# EAGLE design LED Panel v1 (EAGLE 5.03)
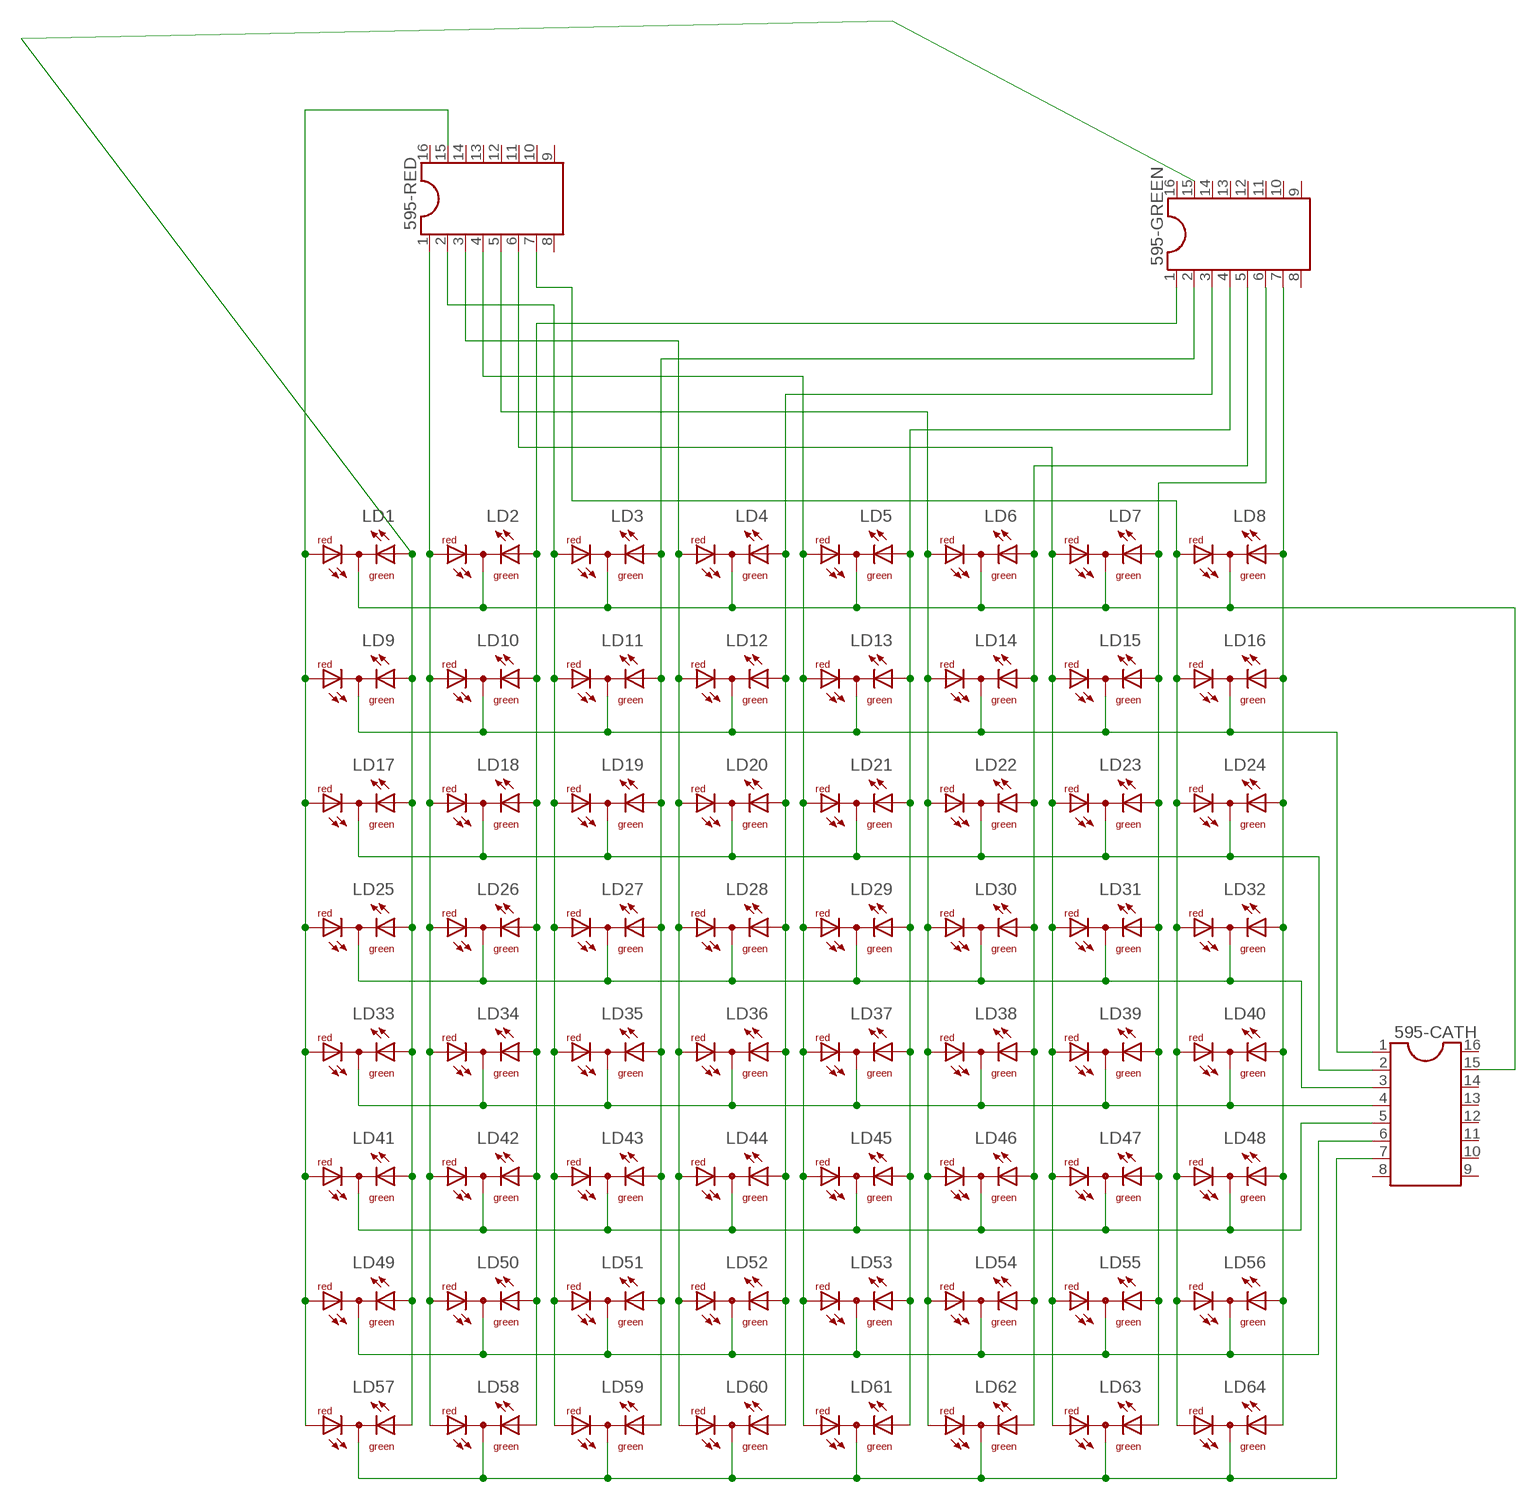
[diagram p0: schematic, sheet 1]

## Parts
595-CATH  DIL16  [DIL16]
595-GREEN  DIL16  [DIL16]
595-RED  DIL16  [DIL16]
LD1  DUOLED-RG-C  [DUOLED-C-5MM]
LD2  DUOLED-RG-C  [DUOLED-C-5MM]
LD3  DUOLED-RG-C  [DUOLED-C-5MM]
LD4  DUOLED-RG-C  [DUOLED-C-5MM]
LD5  DUOLED-RG-C  [DUOLED-C-5MM]
LD6  DUOLED-RG-C  [DUOLED-C-5MM]
LD7  DUOLED-RG-C  [DUOLED-C-5MM]
LD8  DUOLED-RG-C  [DUOLED-C-5MM]
LD9  DUOLED-RG-C  [DUOLED-C-5MM]
LD10  DUOLED-RG-C  [DUOLED-C-5MM]
LD11  DUOLED-RG-C  [DUOLED-C-5MM]
LD12  DUOLED-RG-C  [DUOLED-C-5MM]
LD13  DUOLED-RG-C  [DUOLED-C-5MM]
LD14  DUOLED-RG-C  [DUOLED-C-5MM]
LD15  DUOLED-RG-C  [DUOLED-C-5MM]
LD16  DUOLED-RG-C  [DUOLED-C-5MM]
LD17  DUOLED-RG-C  [DUOLED-C-5MM]
LD18  DUOLED-RG-C  [DUOLED-C-5MM]
LD19  DUOLED-RG-C  [DUOLED-C-5MM]
LD20  DUOLED-RG-C  [DUOLED-C-5MM]
LD21  DUOLED-RG-C  [DUOLED-C-5MM]
LD22  DUOLED-RG-C  [DUOLED-C-5MM]
LD23  DUOLED-RG-C  [DUOLED-C-5MM]
LD24  DUOLED-RG-C  [DUOLED-C-5MM]
LD25  DUOLED-RG-C  [DUOLED-C-5MM]
LD26  DUOLED-RG-C  [DUOLED-C-5MM]
LD27  DUOLED-RG-C  [DUOLED-C-5MM]
LD28  DUOLED-RG-C  [DUOLED-C-5MM]
LD29  DUOLED-RG-C  [DUOLED-C-5MM]
LD30  DUOLED-RG-C  [DUOLED-C-5MM]
LD31  DUOLED-RG-C  [DUOLED-C-5MM]
LD32  DUOLED-RG-C  [DUOLED-C-5MM]
LD33  DUOLED-RG-C  [DUOLED-C-5MM]
LD34  DUOLED-RG-C  [DUOLED-C-5MM]
LD35  DUOLED-RG-C  [DUOLED-C-5MM]
LD36  DUOLED-RG-C  [DUOLED-C-5MM]
LD37  DUOLED-RG-C  [DUOLED-C-5MM]
LD38  DUOLED-RG-C  [DUOLED-C-5MM]
LD39  DUOLED-RG-C  [DUOLED-C-5MM]
LD40  DUOLED-RG-C  [DUOLED-C-5MM]
LD41  DUOLED-RG-C  [DUOLED-C-5MM]
LD42  DUOLED-RG-C  [DUOLED-C-5MM]
LD43  DUOLED-RG-C  [DUOLED-C-5MM]
LD44  DUOLED-RG-C  [DUOLED-C-5MM]
LD45  DUOLED-RG-C  [DUOLED-C-5MM]
LD46  DUOLED-RG-C  [DUOLED-C-5MM]
LD47  DUOLED-RG-C  [DUOLED-C-5MM]
LD48  DUOLED-RG-C  [DUOLED-C-5MM]
LD49  DUOLED-RG-C  [DUOLED-C-5MM]
LD50  DUOLED-RG-C  [DUOLED-C-5MM]
LD51  DUOLED-RG-C  [DUOLED-C-5MM]
LD52  DUOLED-RG-C  [DUOLED-C-5MM]
LD53  DUOLED-RG-C  [DUOLED-C-5MM]
LD54  DUOLED-RG-C  [DUOLED-C-5MM]
LD55  DUOLED-RG-C  [DUOLED-C-5MM]
LD56  DUOLED-RG-C  [DUOLED-C-5MM]
LD57  DUOLED-RG-C  [DUOLED-C-5MM]
LD58  DUOLED-RG-C  [DUOLED-C-5MM]
LD59  DUOLED-RG-C  [DUOLED-C-5MM]
LD60  DUOLED-RG-C  [DUOLED-C-5MM]
LD61  DUOLED-RG-C  [DUOLED-C-5MM]
LD62  DUOLED-RG-C  [DUOLED-C-5MM]
LD63  DUOLED-RG-C  [DUOLED-C-5MM]
LD64  DUOLED-RG-C  [DUOLED-C-5MM]

## Nets
CATH-0: 595-CATH.15 LD1.C LD2.C LD3.C LD4.C LD5.C LD6.C LD7.C LD8.C
CATH-1: 595-CATH.1 LD9.C LD10.C LD11.C LD12.C LD13.C LD14.C LD15.C LD16.C
CATH-2: 595-CATH.2 LD17.C LD18.C LD19.C LD20.C LD21.C LD22.C LD23.C LD24.C
CATH-3: 595-CATH.3 LD25.C LD26.C LD27.C LD28.C LD29.C LD30.C LD31.C LD32.C
CATH-4: 595-CATH.4 LD33.C LD34.C LD35.C LD36.C LD37.C LD38.C LD39.C LD40.C
CATH-5: 595-CATH.5 LD41.C LD42.C LD43.C LD44.C LD45.C LD46.C LD47.C LD48.C
CATH-6: 595-CATH.6 LD49.C LD50.C LD51.C LD52.C LD53.C LD54.C LD55.C LD56.C
CATH-7\: 595-CATH.7 LD57.C LD58.C LD59.C LD60.C LD61.C LD62.C LD63.C LD64.C
GREEN-0: 595-GREEN.15 LD1.AX(AG) LD9.AX(AG) LD17.AX(AG) LD25.AX(AG) LD33.AX(AG) LD41.AX(AG) LD49.AX(AG) LD57.AX(AG)
GREEN-1: 595-GREEN.1 LD2.AX(AG) LD10.AX(AG) LD18.AX(AG) LD26.AX(AG) LD34.AX(AG) LD42.AX(AG) LD50.AX(AG) LD58.AX(AG)
GREEN-2: 595-GREEN.2 LD3.AX(AG) LD11.AX(AG) LD19.AX(AG) LD27.AX(AG) LD35.AX(AG) LD43.AX(AG) LD51.AX(AG) LD59.AX(AG)
GREEN-3: 595-GREEN.3 LD4.AX(AG) LD12.AX(AG) LD20.AX(AG) LD28.AX(AG) LD36.AX(AG) LD44.AX(AG) LD52.AX(AG) LD60.AX(AG)
GREEN-4: 595-GREEN.4 LD5.AX(AG) LD13.AX(AG) LD21.AX(AG) LD29.AX(AG) LD37.AX(AG) LD45.AX(AG) LD53.AX(AG) LD61.AX(AG)
GREEN-5: 595-GREEN.5 LD6.AX(AG) LD14.AX(AG) LD22.AX(AG) LD30.AX(AG) LD38.AX(AG) LD46.AX(AG) LD54.AX(AG) LD62.AX(AG)
GREEN-6: 595-GREEN.6 LD7.AX(AG) LD15.AX(AG) LD23.AX(AG) LD31.AX(AG) LD39.AX(AG) LD47.AX(AG) LD55.AX(AG) LD63.AX(AG)
GREEN-7: 595-GREEN.7 LD8.AX(AG) LD16.AX(AG) LD24.AX(AG) LD32.AX(AG) LD40.AX(AG) LD48.AX(AG) LD56.AX(AG) LD64.AX(AG)
RED-0: 595-RED.15 LD1.AR LD9.AR LD17.AR LD25.AR LD33.AR LD41.AR LD49.AR LD57.AR
RED-1: 595-RED.1 LD2.AR LD10.AR LD18.AR LD26.AR LD34.AR LD42.AR LD50.AR LD58.AR
RED-2: 595-RED.2 LD3.AR LD11.AR LD19.AR LD27.AR LD35.AR LD43.AR LD51.AR LD59.AR
RED-3: 595-RED.3 LD4.AR LD12.AR LD20.AR LD28.AR LD36.AR LD44.AR LD52.AR LD60.AR
RED-4: 595-RED.4 LD5.AR LD13.AR LD21.AR LD29.AR LD37.AR LD45.AR LD53.AR LD61.AR
RED-5: 595-RED.5 LD6.AR LD14.AR LD22.AR LD30.AR LD38.AR LD46.AR LD54.AR LD62.AR
RED-6: 595-RED.6 LD7.AR LD15.AR LD23.AR LD31.AR LD39.AR LD47.AR LD55.AR LD63.AR
RED-7: 595-RED.7 LD8.AR LD16.AR LD24.AR LD32.AR LD40.AR LD48.AR LD56.AR LD64.AR
Unconnected: 595-CATH.8 595-CATH.9 595-CATH.10 595-CATH.11 595-CATH.12 595-CATH.13 595-CATH.14 595-CATH.16 595-GREEN.8 595-GREEN.9 595-GREEN.10 595-GREEN.11 595-GREEN.12 595-GREEN.13 595-GREEN.14 595-GREEN.16 595-RED.8 595-RED.9 595-RED.10 595-RED.11 595-RED.12 595-RED.13 595-RED.14 595-RED.16

## Library data of the parts
595-CATH 595-GREEN 595-RED = ic-package:DIL16: Dual In Line / Socket
LD1-LD64 = led:DUOLED-RG-C: DUO LED 2 colors (red/green), 5 mm, round, common Cathode www.ligitek.com or other producers.

## Board
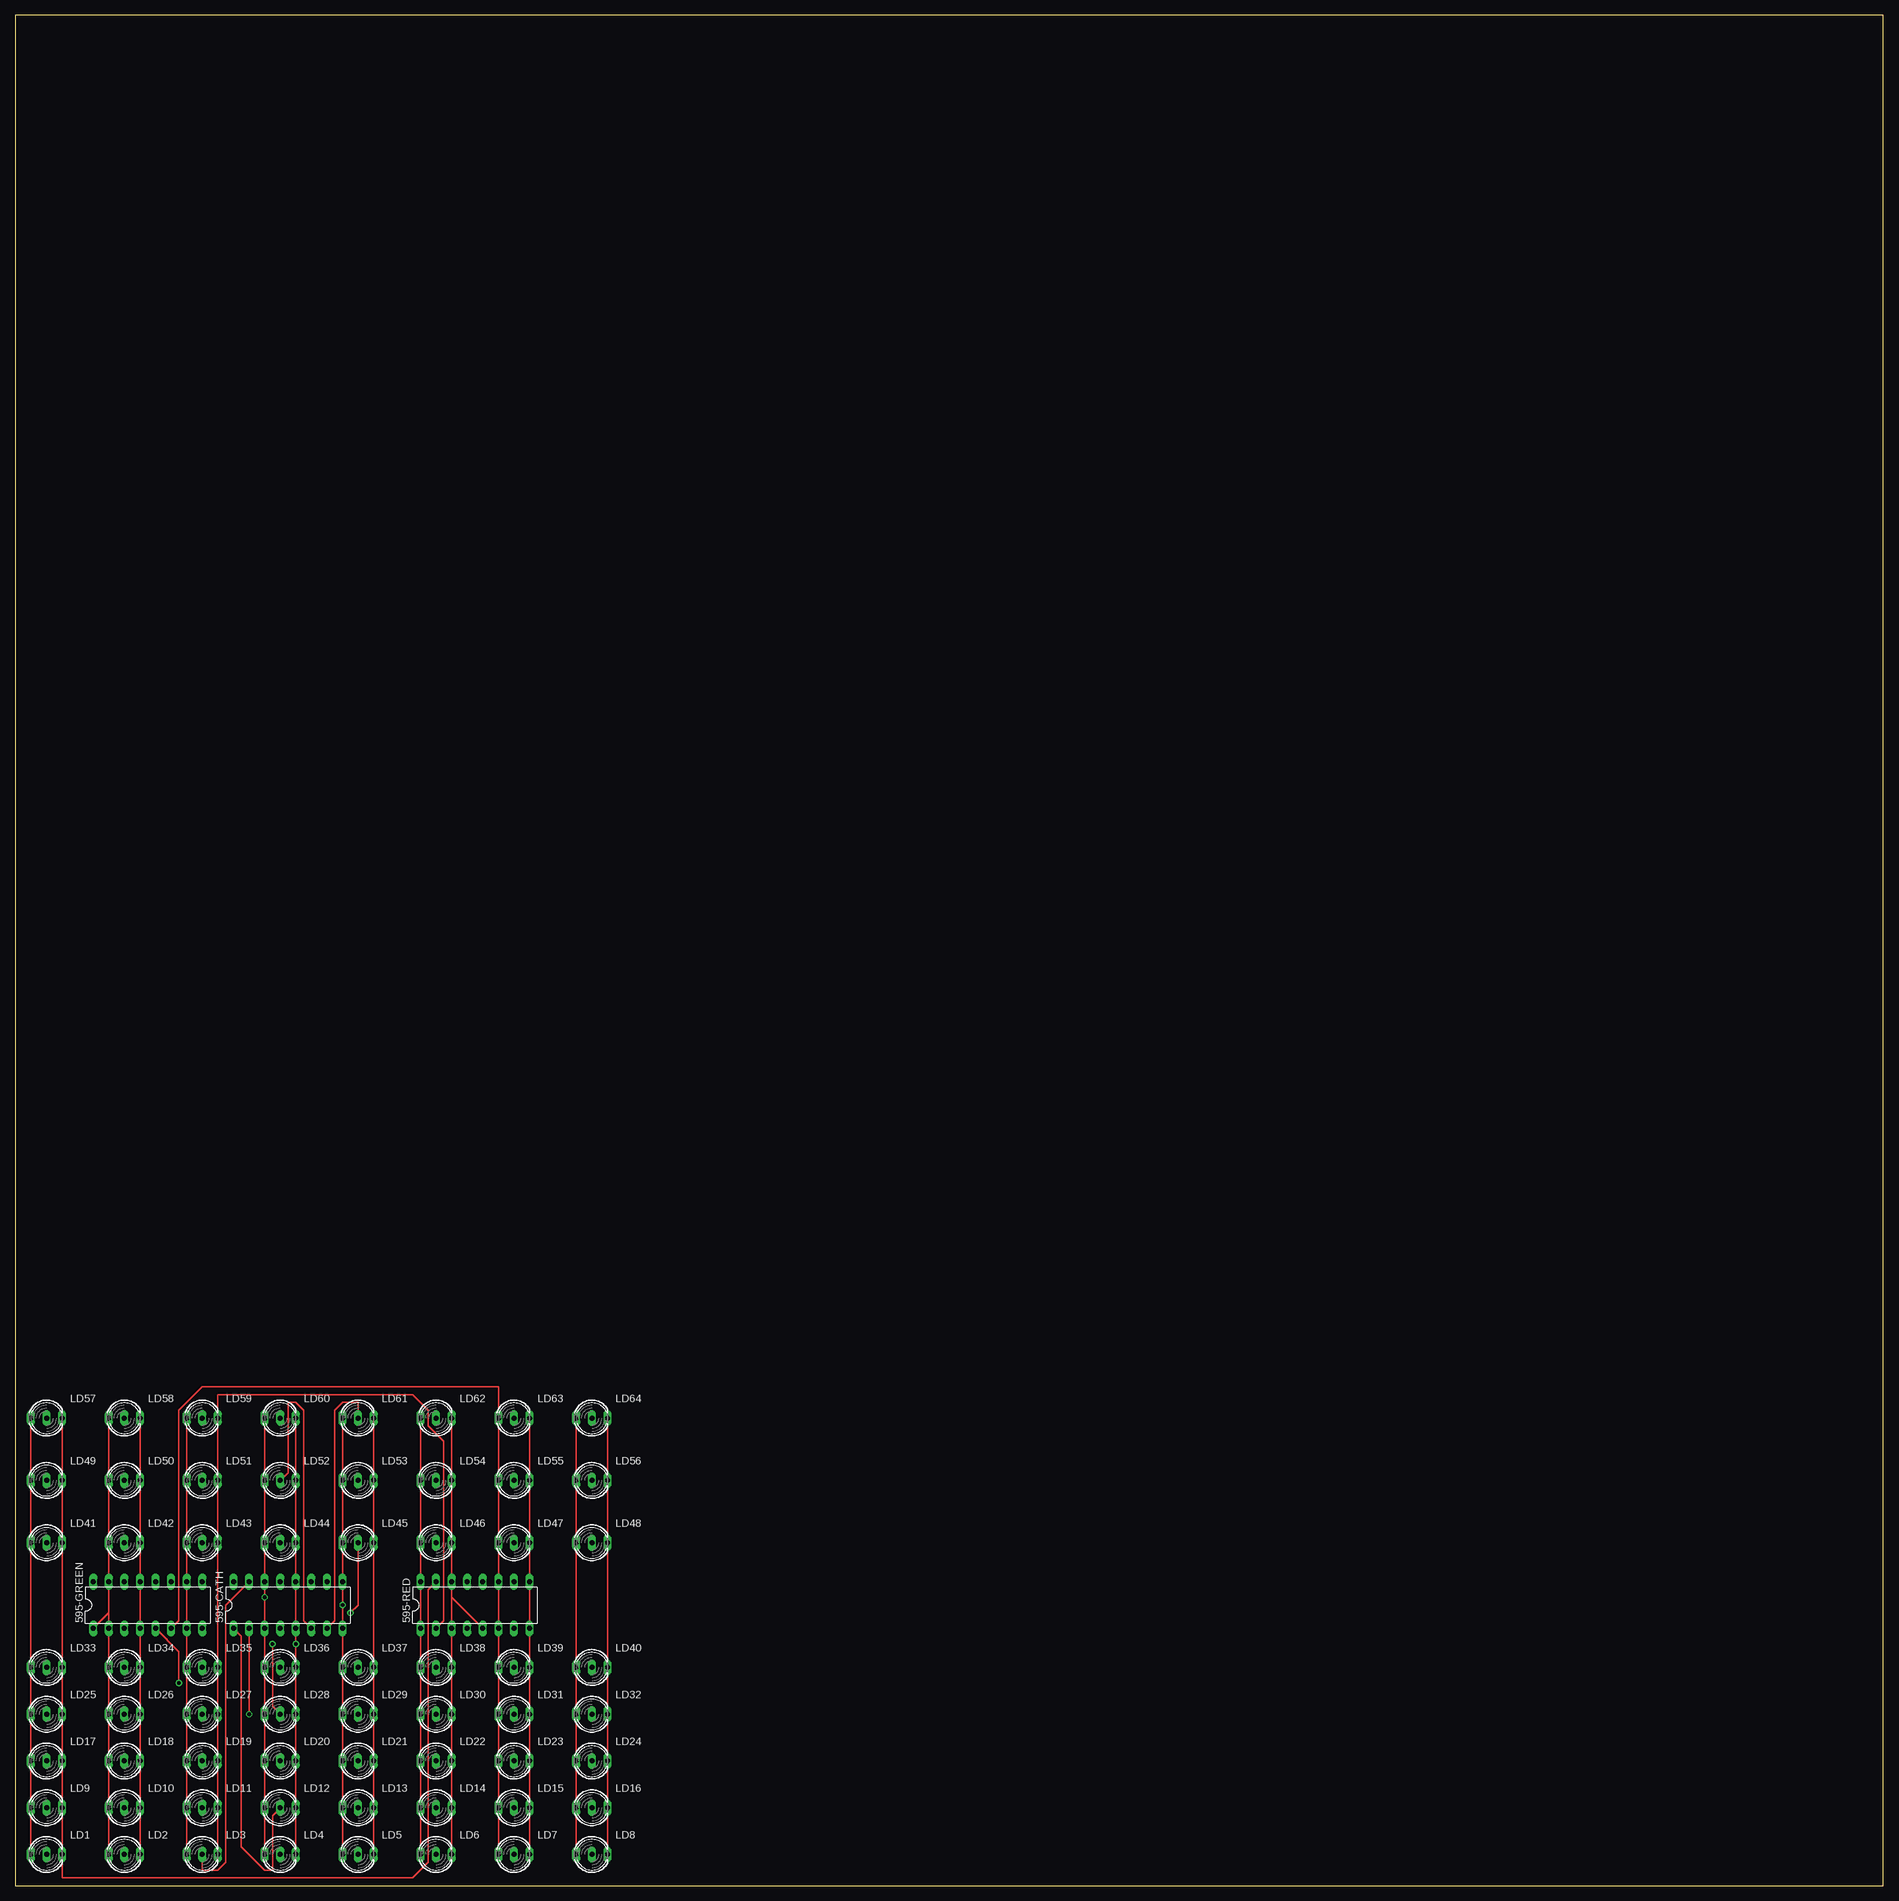
[diagram p1: board, top side]
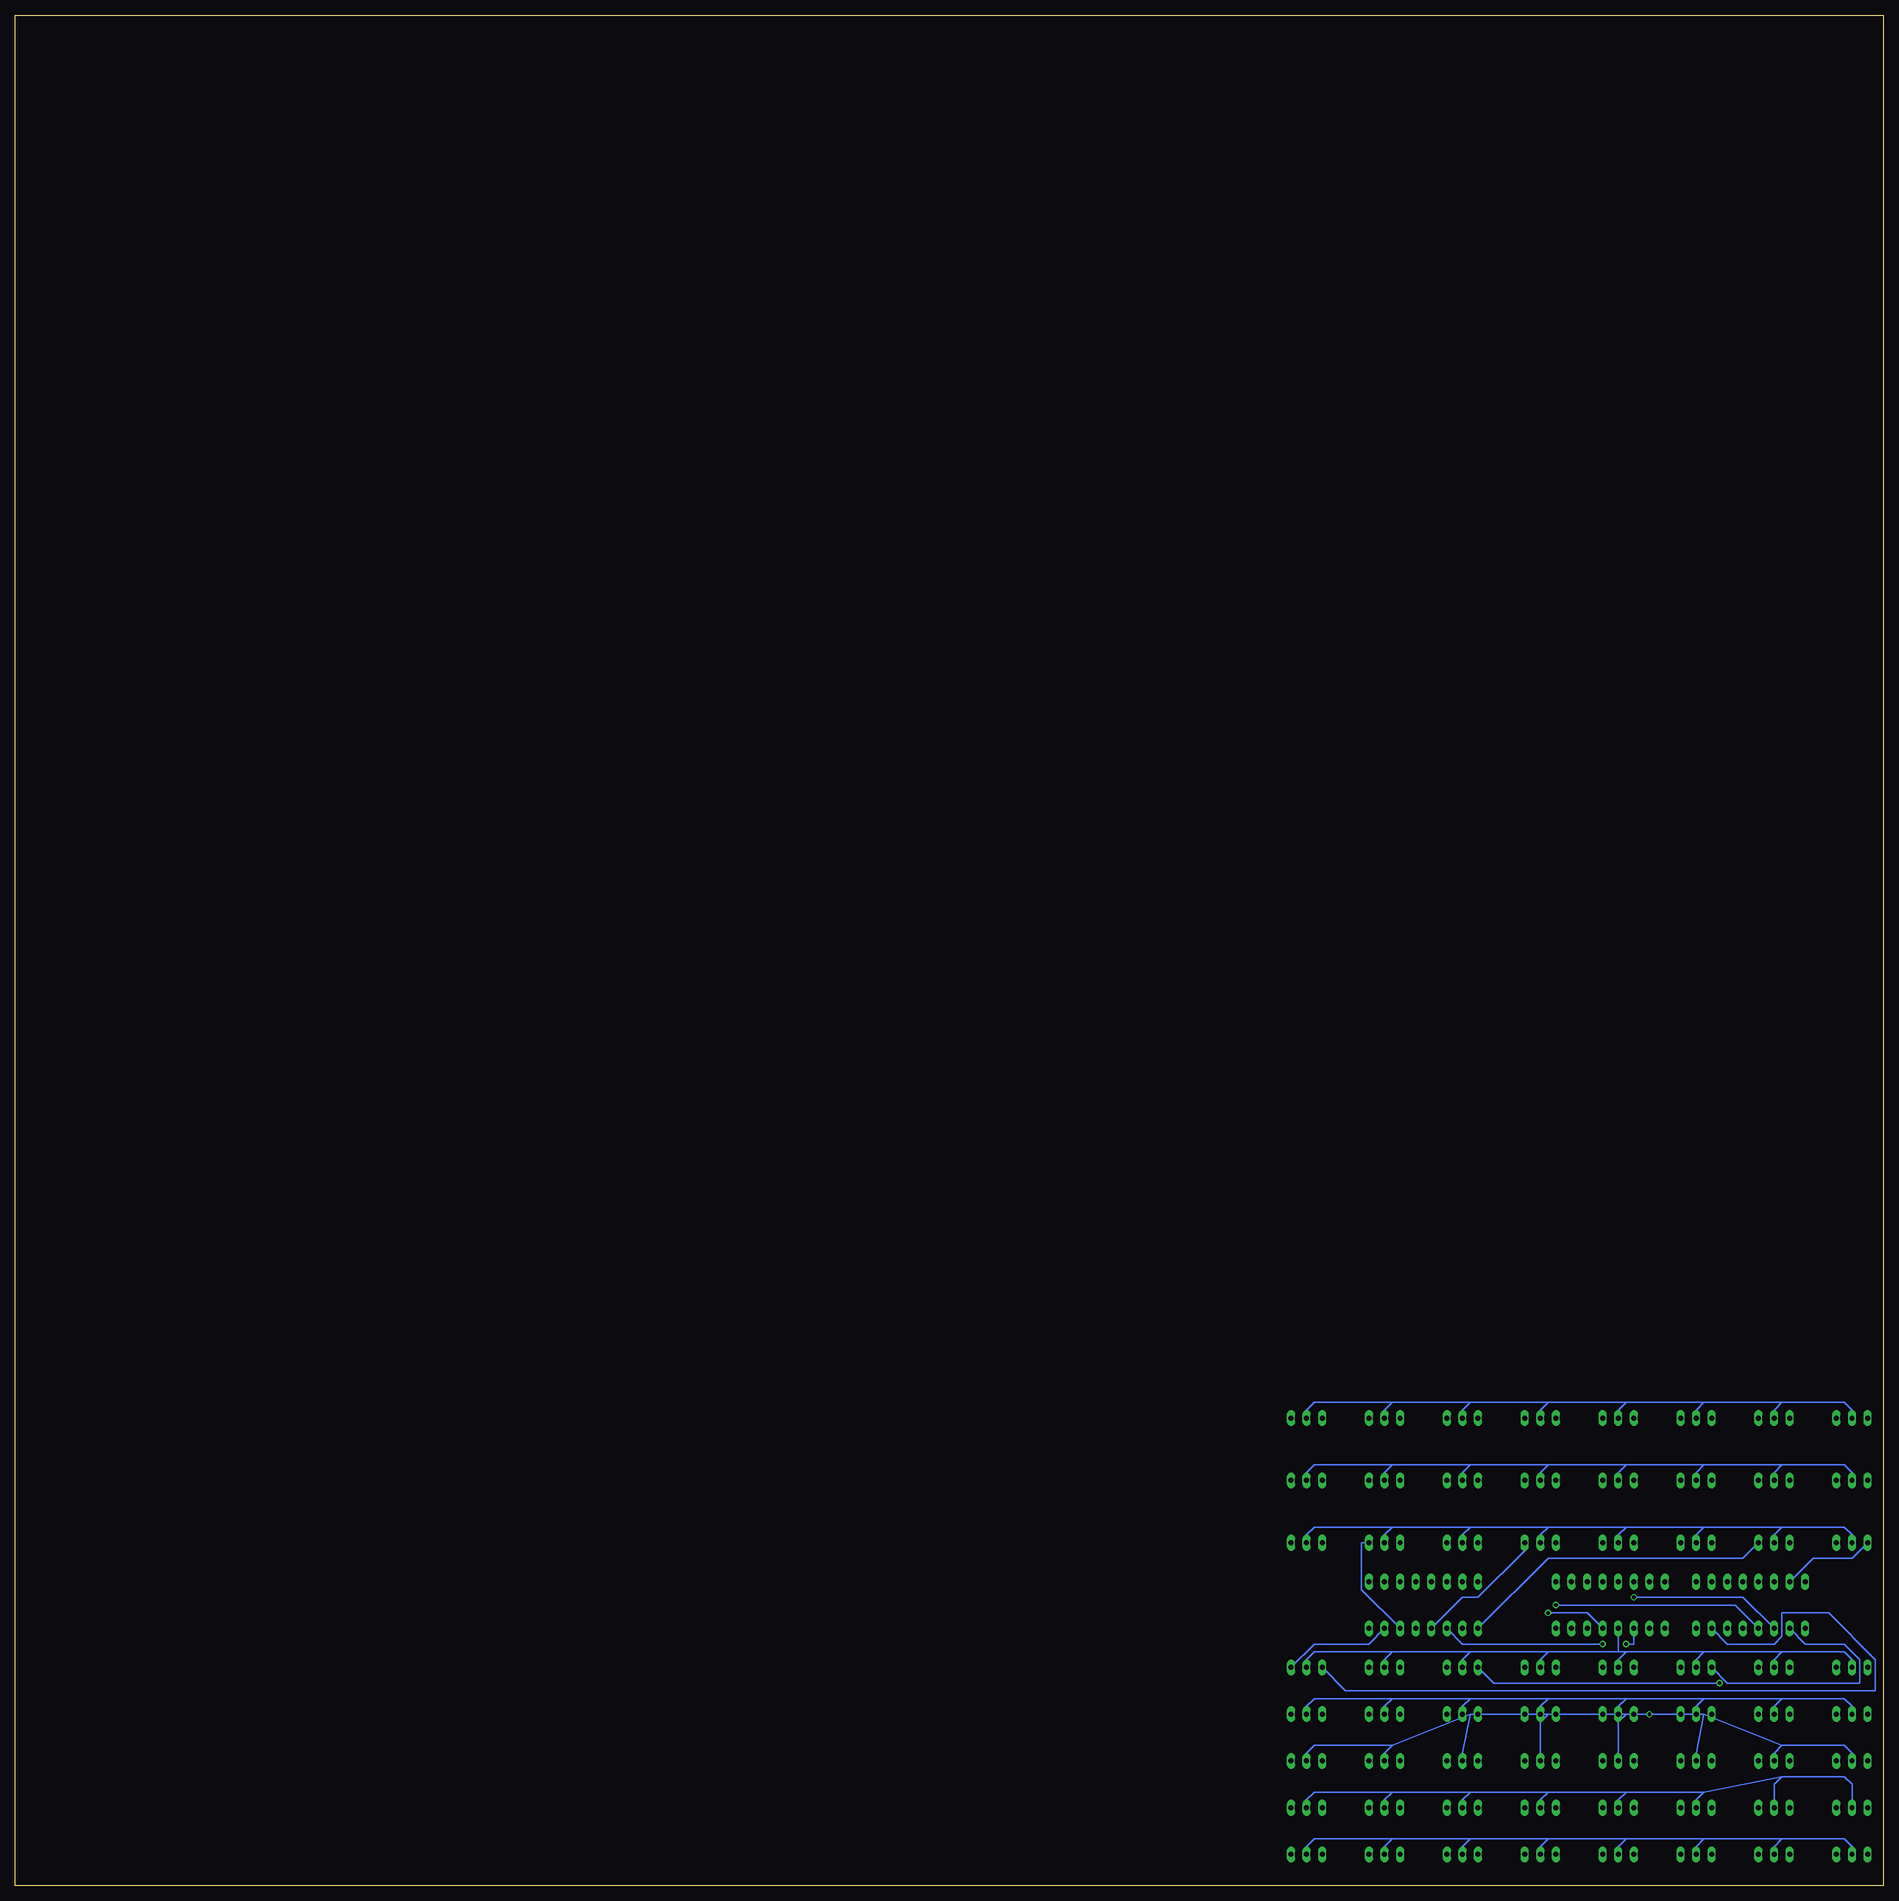
[diagram p2: board, bottom side, seen from below]

Size 304.47 x 304.79 mm. Coordinates in mm from the lower left corner, seen from the top.
Outline: 0,0 304.47,0 304.47,304.79 0,304.79 0,0
Copper layers (1*16): Top 0.035mm / dielectric 1.5mm / Bottom 0.035mm
Design rules "default": minimum track width 10mil, minimum drill 24mil, track to track 8mil, track to pad 8mil, pad to pad 8mil, via to via 8mil, smd to smd 8mil, copper to edge 40mil, drill to drill 8mil, minimum pad ring 10mil, minimum via ring 8mil, stop-mask expansion 4mil, vias tented up to drill 0mil, thermal gap 10mil

### Footprints (pad centres in the part's own frame; a part is rotated, then mirrored left to right if it is on the bottom)
DIL16 = drill 0.813 long: 1 -8.89,-3.81; 2 -6.35,-3.81; 3 -3.81,-3.81; 4 -1.27,-3.81; 5 1.27,-3.81; 6 3.81,-3.81; 7 6.35,-3.81; 8 8.89,-3.81; 9 8.89,3.81; 10 6.35,3.81; 11 3.81,3.81; 12 1.27,3.81; 13 -1.27,3.81; 14 -3.81,3.81; 15 -6.35,3.81; 16 -8.89,3.81
DUOLED-C-5MM = drill 0.813 long: AR 2.54,0; AX -2.54,0; C 0,0

### Placement (x,y rotation side)
595-CATH  44.45,45.72 0 top
595-GREEN  21.59,45.72 0 top
595-RED  74.93,45.72 0 top
LD1  5.08,5.08 0 top
LD2  17.78,5.08 0 top
LD3  30.48,5.08 0 top
LD4  43.18,5.08 0 top
LD5  55.88,5.08 0 top
LD6  68.58,5.08 0 top
LD7  81.28,5.08 0 top
LD8  93.98,5.08 0 top
LD9  5.08,12.7 0 top
LD10  17.78,12.7 0 top
LD11  30.48,12.7 0 top
LD12  43.18,12.7 0 top
LD13  55.88,12.7 0 top
LD14  68.58,12.7 0 top
LD15  81.28,12.7 0 top
LD16  93.98,12.7 0 top
LD17  5.08,20.32 0 top
LD18  17.78,20.32 0 top
LD19  30.48,20.32 0 top
LD20  43.18,20.32 0 top
LD21  55.88,20.32 0 top
LD22  68.58,20.32 0 top
LD23  81.28,20.32 0 top
LD24  93.98,20.32 0 top
LD25  5.08,27.94 0 top
LD26  17.78,27.94 0 top
LD27  30.48,27.94 0 top
LD28  43.18,27.94 0 top
LD29  55.88,27.94 0 top
LD30  68.58,27.94 0 top
LD31  81.28,27.94 0 top
LD32  93.98,27.94 0 top
LD33  5.08,35.56 0 top
LD34  17.78,35.56 0 top
LD35  30.48,35.56 0 top
LD36  43.18,35.56 0 top
LD37  55.88,35.56 0 top
LD38  68.58,35.56 0 top
LD39  81.28,35.56 0 top
LD40  93.98,35.56 0 top
LD41  5.08,55.88 0 top
LD42  17.78,55.88 0 top
LD43  30.48,55.88 0 top
LD44  43.18,55.88 0 top
LD45  55.88,55.88 0 top
LD46  68.58,55.88 0 top
LD47  81.28,55.88 0 top
LD48  93.98,55.88 0 top
LD49  5.08,66.04 0 top
LD50  17.78,66.04 0 top
LD51  30.48,66.04 0 top
LD52  43.18,66.04 0 top
LD53  55.88,66.04 0 top
LD54  68.58,66.04 0 top
LD55  81.28,66.04 0 top
LD56  93.98,66.04 0 top
LD57  5.08,76.2 0 top
LD58  17.78,76.2 0 top
LD59  30.48,76.2 0 top
LD60  43.18,76.2 0 top
LD61  55.88,76.2 0 top
LD62  68.58,76.2 0 top
LD63  81.28,76.2 0 top
LD64  93.98,76.2 0 top

### Tracks (layer width: path | path; a pad name or v marks a point on that pad's centre or on a via)
CATH-0
  Top 0.254: 595-CATH.15 34.29,45.72 34.29,3.81 33.02,2.54 30.48,2.54 LD3.C
  Bottom 0.254: 16.51,7.62 6.35,7.62 5.08,6.35 LD1.C | 16.51,7.62 17.78,6.35 LD2.C | 29.21,7.62 30.48,6.35 LD3.C | 16.51,7.62 29.21,7.62 | 41.91,7.62 43.18,6.35 LD4.C | 29.21,7.62 41.91,7.62 | 54.61,7.62 55.88,6.35 LD5.C | 41.91,7.62 54.61,7.62 | 67.31,7.62 68.58,6.35 LD6.C | 54.61,7.62 67.31,7.62 | 80.01,7.62 81.28,6.35 LD7.C | 67.31,7.62 80.01,7.62 | 80.01,7.62 92.71,7.62 93.98,6.35 LD8.C
CATH-1
  Top 0.254: 595-CATH.1 36.83,40.64 36.83,6.35 40.64,2.54 41.91,2.54 41.91,11.43 LD12.C
  Bottom 0.254: 16.51,17.78 6.35,17.78 5.08,16.51 LD9.C | 16.51,17.78 17.78,16.51 LD10.C | 29.21,15.24 30.48,13.97 LD11.C | 16.51,17.78 29.21,15.24 | 41.91,15.24 43.18,13.97 LD12.C | 29.21,15.24 41.91,15.24 | 54.61,15.24 55.88,13.97 LD13.C | 41.91,15.24 54.61,15.24 | 67.31,15.24 68.58,13.97 LD14.C | 54.61,15.24 67.31,15.24 | 80.01,15.24 81.28,13.97 LD15.C | 67.31,15.24 80.01,15.24 | 80.01,15.24 92.71,15.24 93.98,13.97 LD16.C
CATH-2  (via drill 0.61)
  Top 0.254: v38.1,27.94 595-CATH.2
  Bottom 0.254: 16.51,22.86 6.35,22.86 5.08,21.59 LD17.C | 16.51,22.86 17.78,21.59 LD18.C | 29.21,27.94 30.48,21.59 LD19.C | 16.51,22.86 29.21,27.94 | 41.91,27.94 43.18,26.67 LD20.C | 29.21,27.94 v38.1,27.94 41.91,27.94 | 54.61,27.94 55.88,26.67 LD21.C | 41.91,27.94 54.61,27.94 | 67.31,27.94 68.58,21.59 LD22.C | 54.61,27.94 67.31,27.94 | 80.01,22.86 81.28,21.59 LD23.C | 67.31,27.94 80.01,22.86 | 80.01,22.86 92.71,22.86 93.98,21.59 LD24.C
CATH-3  (via drill 0.61)
  Top 0.254: v41.91,39.37 41.91,29.21 LD28.C
  Bottom 0.254: 16.51,30.48 6.35,30.48 5.08,29.21 LD25.C | 16.51,30.48 17.78,29.21 LD26.C | 29.21,30.48 30.48,29.21 LD27.C | 16.51,30.48 29.21,30.48 | 41.91,30.48 43.18,29.21 LD28.C | 29.21,30.48 41.91,30.48 | 54.61,30.48 55.88,29.21 LD29.C | 41.91,30.48 54.61,30.48 | 67.31,30.48 68.58,29.21 LD30.C | 54.61,30.48 67.31,30.48 | 80.01,30.48 81.28,29.21 LD31.C | 67.31,30.48 80.01,30.48 | 80.01,30.48 92.71,30.48 93.98,29.21 LD32.C | 595-CATH.3 40.64,39.37 v41.91,39.37
CATH-4
  Bottom 0.254: 16.51,38.1 6.35,38.1 5.08,36.83 LD33.C | 16.51,38.1 17.78,36.83 LD34.C | 29.21,38.1 30.48,36.83 LD35.C | 16.51,38.1 29.21,38.1 | 41.91,38.1 43.18,36.83 LD36.C | 29.21,38.1 41.91,38.1 | 54.61,38.1 55.88,36.83 LD37.C | 41.91,38.1 43.18,38.1 | 43.18,38.1 54.61,38.1 | 67.31,38.1 68.58,36.83 LD38.C | 54.61,38.1 67.31,38.1 | 80.01,38.1 81.28,36.83 LD39.C | 67.31,38.1 80.01,38.1 | 80.01,38.1 92.71,38.1 93.98,36.83 LD40.C | 43.18,38.1 595-CATH.4
CATH-5  (via drill 0.61)
  Top 0.254: v54.61,44.45 55.88,45.72 LD45.C
  Bottom 0.254: 16.51,58.42 6.35,58.42 5.08,57.15 LD41.C | 16.51,58.42 17.78,57.15 LD42.C | 29.21,58.42 30.48,57.15 LD43.C | 16.51,58.42 29.21,58.42 | 41.91,58.42 43.18,57.15 LD44.C | 29.21,58.42 41.91,58.42 | 54.61,58.42 55.88,57.15 LD45.C | 41.91,58.42 54.61,58.42 | 67.31,58.42 68.58,57.15 LD46.C | 54.61,58.42 67.31,58.42 | 80.01,58.42 81.28,57.15 LD47.C | 67.31,58.42 80.01,58.42 | 80.01,58.42 92.71,58.42 93.98,57.15 LD48.C | 595-CATH.5 48.26,44.45 v54.61,44.45
CATH-6
  Top 0.254: 595-CATH.6 46.99,43.18 46.99,77.47 45.72,78.74 44.45,78.74 44.45,67.31 LD52.C
  Bottom 0.254: 16.51,68.58 6.35,68.58 5.08,67.31 LD49.C | 16.51,68.58 17.78,67.31 LD50.C | 29.21,68.58 30.48,67.31 LD51.C | 16.51,68.58 29.21,68.58 | 41.91,68.58 43.18,67.31 LD52.C | 29.21,68.58 41.91,68.58 | 54.61,68.58 55.88,67.31 LD53.C | 41.91,68.58 54.61,68.58 | 67.31,68.58 68.58,67.31 LD54.C | 54.61,68.58 67.31,68.58 | 80.01,68.58 81.28,67.31 LD55.C | 67.31,68.58 80.01,68.58 | 80.01,68.58 92.71,68.58 93.98,67.31 LD56.C
CATH-7\
  Top 0.254: 595-CATH.7 52.07,43.18 52.07,77.47 53.34,78.74 55.88,78.74 LD61.C
  Bottom 0.254: 16.51,78.74 6.35,78.74 5.08,77.47 LD57.C | 16.51,78.74 17.78,77.47 LD58.C | 29.21,78.74 30.48,77.47 LD59.C | 16.51,78.74 29.21,78.74 | 41.91,78.74 43.18,77.47 LD60.C | 29.21,78.74 41.91,78.74 | 54.61,78.74 55.88,77.47 LD61.C | 41.91,78.74 54.61,78.74 | 67.31,78.74 68.58,77.47 LD62.C | 54.61,78.74 67.31,78.74 | 80.01,78.74 81.28,77.47 LD63.C | 67.31,78.74 80.01,78.74 | 80.01,78.74 92.71,78.74 93.98,77.47 LD64.C
GREEN-0
  Top 0.254: LD57.AX LD49.AX LD41.AX LD33.AX LD25.AX LD17.AX LD9.AX LD1.AX
  Bottom 0.254: 595-GREEN.15 11.43,53.34 5.08,53.34 LD41.AX
GREEN-1
  Top 0.254: LD58.AX LD50.AX LD42.AX 15.24,44.45 | 15.24,44.45 LD34.AX LD26.AX LD18.AX LD10.AX LD2.AX | 15.24,44.45 595-GREEN.1
GREEN-2
  Top 0.254: LD59.AX LD51.AX LD43.AX LD35.AX LD27.AX LD19.AX LD11.AX LD3.AX
  Bottom 0.254: 595-GREEN.2 12.7,39.37 6.35,39.37 3.81,36.83 3.81,33.02 25.4,33.02 LD35.AX
GREEN-3  (via drill 0.61)
  Top 0.254: LD60.AX LD52.AX LD44.AX v40.64,46.99 LD36.AX LD28.AX LD20.AX LD12.AX LD4.AX
  Bottom 0.254: 595-GREEN.3 22.86,46.99 v40.64,46.99
GREEN-4  (via drill 0.61)
  Top 0.254: LD61.AX LD53.AX LD45.AX v53.34,45.72 LD37.AX LD29.AX LD21.AX LD13.AX LD5.AX
  Bottom 0.254: 595-GREEN.4 24.13,45.72 v53.34,45.72
GREEN-5  (via drill 0.61)
  Top 0.254: LD62.AX LD54.AX LD46.AX LD38.AX LD30.AX LD22.AX LD14.AX LD6.AX | 595-GREEN.5 26.67,38.1 v26.67,33.02
  Bottom 0.254: v26.67,33.02 63.5,33.02 LD38.AX
GREEN-6
  Top 0.254: LD7.AX LD15.AX LD23.AX LD31.AX LD39.AX LD47.AX LD55.AX LD63.AX 78.74,81.28 30.48,81.28 26.67,77.47 26.67,43.18 595-GREEN.6
GREEN-7
  Top 0.254: LD64.AX LD56.AX LD48.AX LD40.AX LD32.AX LD24.AX LD16.AX LD8.AX
  Bottom 0.254: 595-GREEN.7 25.4,39.37 17.78,39.37 16.51,40.64 16.51,44.45 8.89,44.45 1.27,36.83 1.27,31.75 87.63,31.75 LD40.AX
RED-0
  Top 0.254: LD57.AR LD49.AR LD41.AR LD33.AR LD25.AR LD17.AR LD9.AR LD1.AR 7.62,1.27 64.77,1.27 67.31,3.81 67.31,48.26 595-RED.15
RED-1
  Top 0.254: LD58.AR LD50.AR LD42.AR LD34.AR LD26.AR LD18.AR LD10.AR LD2.AR
  Bottom 0.254: 595-RED.1 54.61,53.34 22.86,53.34 LD42.AR
RED-2
  Top 0.254: LD3.AR LD11.AR LD19.AR LD27.AR LD35.AR LD43.AR LD51.AR LD59.AR 33.02,80.01 64.77,80.01 67.31,77.47 67.31,74.93 69.85,72.39 69.85,43.18 595-RED.2
RED-3  (via drill 0.61)
  Top 0.254: LD60.AR LD52.AR LD44.AR v45.72,39.37 LD36.AR LD28.AR LD20.AR LD12.AR LD4.AR
  Bottom 0.254: 595-RED.3 68.58,39.37 v45.72,39.37
RED-4
  Top 0.254: LD61.AR LD53.AR LD45.AR LD37.AR LD29.AR LD21.AR LD13.AR LD5.AR
  Bottom 0.254: 595-RED.4 68.58,46.99 66.04,46.99 58.42,54.61 LD45.AR
RED-5
  Top 0.254: LD62.AR LD54.AR LD46.AR 71.12,46.99 | 71.12,46.99 LD38.AR LD30.AR LD22.AR LD14.AR LD6.AR | 71.12,46.99 595-RED.5
RED-6
  Top 0.254: LD63.AR LD55.AR LD47.AR LD39.AR LD31.AR LD23.AR LD15.AR LD7.AR
  Bottom 0.254: 595-RED.6 85.09,48.26 85.09,55.88 LD47.AR
RED-7
  Top 0.254: LD64.AR LD56.AR LD48.AR LD40.AR LD32.AR LD24.AR LD16.AR LD8.AR
  Bottom 0.254: 595-RED.7 83.82,39.37 92.71,39.37 LD40.AR